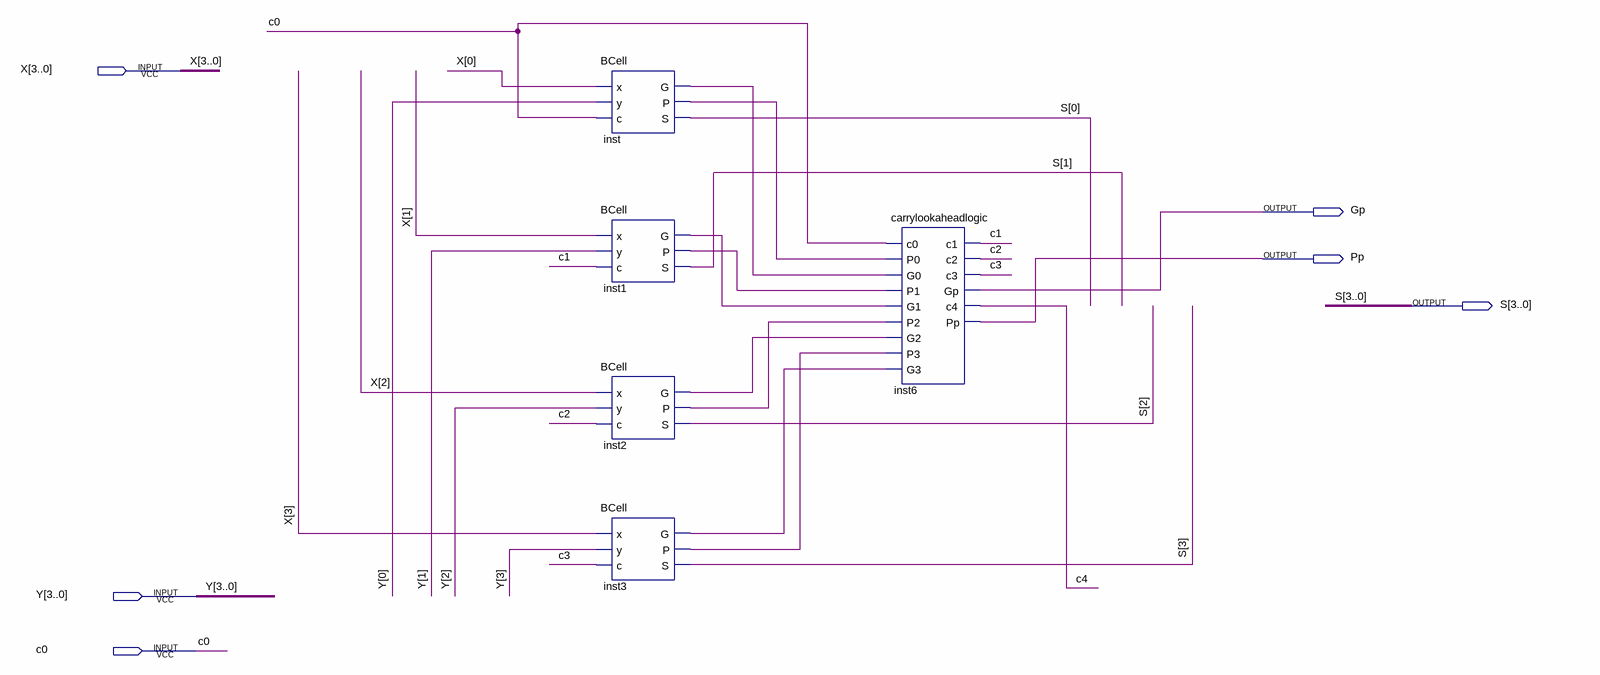
[diagram p0: schematic sheet]
// Quartus schematic FourBitAdder.bdf as structural Verilog: 5 symbols, 6 pins
module FourBitAdder (
  input  [3:0] X,
  input  [3:0] Y,
  input  c0,
  output Gp,
  output Pp,
  output [3:0] S
);

  wire c1, c2, c3, c4, inst1_g, inst1_p, inst2_g, inst2_p, inst3_g, inst3_p, inst_g, inst_p;

  BCell inst (.x(X[0]), .y(Y[0]), .c(c0), .G(inst_g), .P(inst_p), .S(S[0]));
  BCell inst1 (.x(X[1]), .y(Y[1]), .c(c1), .G(inst1_g), .P(inst1_p), .S(S[1]));
  BCell inst2 (.x(X[2]), .y(Y[2]), .c(c2), .G(inst2_g), .P(inst2_p), .S(S[2]));
  BCell inst3 (.x(X[3]), .y(Y[3]), .c(c3), .G(inst3_g), .P(inst3_p), .S(S[3]));
  carrylookaheadlogic inst6 (
    .c0(c0), .P0(inst_p), .G0(inst_g), .P1(inst1_p), .G1(inst1_g), .P2(inst2_p), .G2(inst2_g), .P3(inst3_p),
    .G3(inst3_g), .c1(c1), .c2(c2), .c3(c3), .Gp(Gp), .c4(c4), .Pp(Pp));
endmodule
